# Altium schematic sheet SingleToDifferential.SchDoc
size A4; Address1: TH Nürnberg; Address2: Georg Simon Ohm; Address3: Kesslerplatz 10; Address4: 90489 Nürnberg; SheetNumber: 5; SheetTotal: 8
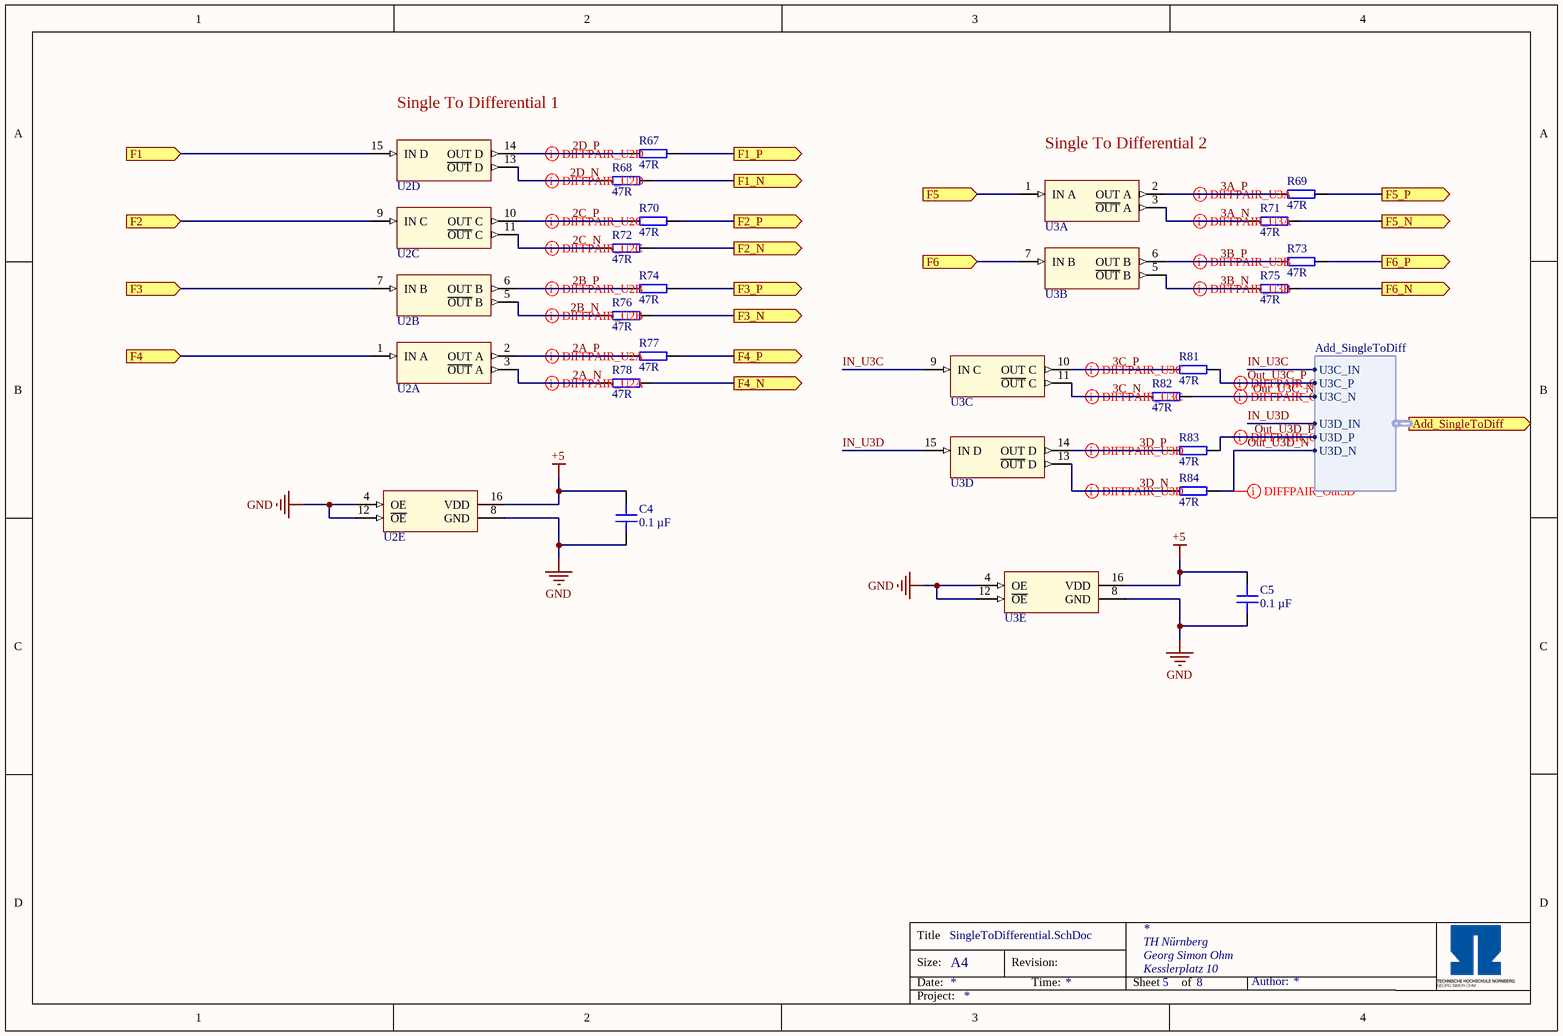
[diagram p0: SingleToDifferential.SchDoc]

## Parts
C4  0.1 µF  [C_0603]
C5  0.1 µF  [C_0603]
R67  47R  [RES 0603_1608]
R68  47R  [RES 0603_1608]
R69  47R  [RES 0603_1608]
R70  47R  [RES 0603_1608]
R71  47R  [RES 0603_1608]
R72  47R  [RES 0603_1608]
R73  47R  [RES 0603_1608]
R74  47R  [RES 0603_1608]
R75  47R  [RES 0603_1608]
R76  47R  [RES 0603_1608]
R77  47R  [RES 0603_1608]
R78  47R  [RES 0603_1608]
R81  47R  [RES 0603_1608]
R82  47R  [RES 0603_1608]
R83  47R  [RES 0603_1608]
R84  47R  [RES 0603_1608]
U2  DS26C31TMX/NOPB  [TI_D-R-PDSO-G16_N]  (value not drawn)  (parts A,B,C,D,E of 5)
U3  DS26C31TMX/NOPB  [TI_D-R-PDSO-G16_N]  (value not drawn)  (parts A,B,C,D,E of 5)

## Ports
Add_SingleToDiff (out, harness Add_SingleToDiff), F1 (in), F1_N (out), F1_P (out), F2 (in), F2_N (out), F2_P (out), F3 (in), F3_N (out), F3_P (out), F4 (in), F4_N (out), F4_P (out), F5 (in), F5_N (out), F5_P (out), F6 (in), F6_N (out), F6_P (out)

## Harnesses
Add_SingleToDiff: U3C_IN, U3C_P, U3C_N, U3D_IN, U3D_P, U3D_N

## Nets
+5: C4.2 C5.2 U2.16(VDD) U3.16(VDD)
GND: C4.1 C5.1 U2.4(OE) U2.8(GND) U2.12(~{OE}) U3.4(OE) U3.8(GND) U3.12(~{OE})
2A_N: R78.1 U2.3(~{OUT}_A)
2A_P: R77.1 U2.2(OUT_A)
2B_N: R76.1 U2.5(~{OUT}_B)
2B_P: R74.1 U2.6(OUT_B)
2C_N: R72.1 U2.11(~{OUT}_C)
2C_P: R70.1 U2.10(OUT_C)
2D_N: R68.1 U2.13(~{OUT}_D)
2D_P: R67.1 U2.14(OUT_D)
3A_N: R71.1 U3.3(~{OUT}_A)
3A_P: R69.1 U3.2(OUT_A)
3B_N: R75.1 U3.5(~{OUT}_B)
3B_P: R73.1 U3.6(OUT_B)
3C_N: R82.1 U3.11(~{OUT}_C)
3C_P: R81.1 U3.10(OUT_C)
3D_N: R84.1 U3.13(~{OUT}_D)
3D_P: R83.1 U3.14(OUT_D)
F1: U2.15(IN_D) ; port F1
F1_N: R68.2 ; port F1_N
F1_P: R67.2 ; port F1_P
F2: U2.9(IN_C) ; port F2
F2_N: R72.2 ; port F2_N
F2_P: R70.2 ; port F2_P
F3: U2.7(IN_B) ; port F3
F3_N: R76.2 ; port F3_N
F3_P: R74.2 ; port F3_P
F4: U2.1(IN_A) ; port F4
F4_N: R78.2 ; port F4_N
F4_P: R77.2 ; port F4_P
F5: U3.1(IN_A) ; port F5
F5_N: R71.2 ; port F5_N
F5_P: R69.2 ; port F5_P
F6: U3.7(IN_B) ; port F6
F6_N: R75.2 ; port F6_N
F6_P: R73.2 ; port F6_P
IN_U3C: U3.9(IN_C) ; port Add_SingleToDiff.U3C_IN
IN_U3D: U3.15(IN_D) ; port Add_SingleToDiff.U3D_IN
Out_U3C_N: R82.2 ; port Add_SingleToDiff.U3C_N
Out_U3C_P: R81.2 ; port Add_SingleToDiff.U3C_P
Out_U3D_N: R84.2 ; port Add_SingleToDiff.U3D_N
Out_U3D_P: R83.2 ; port Add_SingleToDiff.U3D_P

## Layout directives
differential pair: 2A_N, 2A_P, 2B_N, 2B_P, 2C_N, 2C_P, 2D_N, 2D_P, 3A_N, 3A_P, 3B_N, 3B_P, 3C_N, 3C_P, 3D_N, 3D_P, Out_U3C_N, Out_U3C_P, Out_U3D_N, Out_U3D_P

## Notes on the sheet
- Single To Differential 1
- Single To Differential 2
- Title
- Size:
- Date:
- A4
- Revision:
- Time:
- Sheet
- of
- Author:
- Project:

## Library data of the parts
C4 C5 = C0603C104J3REC7411: Capacitor 0603, 25 VDC, 0.1 µF, X7R; Manufacturer: KEMET; Tolerance: 5 %; Voltage Rating: 25 VDC; Created from: MGremer; Manufacturer Part Number: C0603C104J3REC7411; PartID: 2; Created On: 20.12.2020 13:54:13; ComponentLink1Description: Datasheet; ComponentLink1URL: https://www.mouser.de/datasheet/2/212/1/KEM_C1090_X7R_ESD-1103328.pdf; Component Type: Capacitor 0603; Device Package: 0603; Last Updated: 20.12.2020 16:43:29; Mounting Type: SMD; Operating Temperature: -55 - 125°C; Series: ESD SMD Auto X7R; Supplier 1: Mouser; Supplier Part Number 1: 80-C0603C104J3RE7411; Type: Capacitor; Value: 0.1 µF; Live Cycle Status: 1; Stock number: Labor SMD Container
R67-R78 R81-R84 = RK73B1JTTDD470J: SMD resistor E24 series; Manufacturer: KOA Speer; Tolerance: 5%; Created from: MGremer; Manufacturer Part Number: RK73B1JTTDD470J; PartID: 42; Created On: 14.12.2020 16:17:14; ComponentLink1Description: Datasheet; ComponentLink1URL: https://www.mouser.de/datasheet/2/219/RK73B-1825463.pdf; Component Type: SMD resistor; Device Package: 0603; Last Updated: 04.03.2021 09:09:42; Mounting Type: SMD; Supplier 1: Mouser; Supplier Part Number 1: 660-RK73B1JTTDD470J; Supplier 2: LCSC; Supplier Part Number 2: C23182; Type: Resistor; Value: 47R; Live Cycle Status: 1; Stock number: Labor SMD Container; LCSC Part Number: C23182
U2 U3 = DS26C31TMX/NOPB: CMOS Quad Tri-State Differential Line Drivers, 16-pin Narrow SOIC, Pb-Free; Manufacturer: Texas Instruments; Created from: T. Wendt; Manufacturer Part Number: DS26C31TMX/NOPB; PartID: 1; Created On: 01.03.2021 10:08:45; ComponentLink1Description: Datasheet; ComponentLink1URL: http://www.ti.com/general/docs/lit/getliterature.tsp?genericPartNumber=DS26C31T&fileType=pdf; Component Type: RS422 Driver; Device Package: SOIC; Last Updated: 04.03.2021 09:04:43; Minimum Order: 1; Mounting Type: SMD; Operating Temperature: -40°C - 85°C; Series: DS26C31; Supplier 1: Digi-Key; Supplier Part Number 1: DS26C31TMX/NOPBCT-ND; Supplier 2: Mouser; Supplier Part Number 2: 926-DS26C31TMX/NOPB; Supplier 3: LCSC; Supplier Part Number 3: C132085; Type: Standard; Live Cycle Status: 1; Stock number: not stored; LCSC Part Number: C132085